# Altium project Thunderscope-E.PrjPCB (part 2 of 2)

## Sheet CON_PCIe_X4.SchDoc
size A4
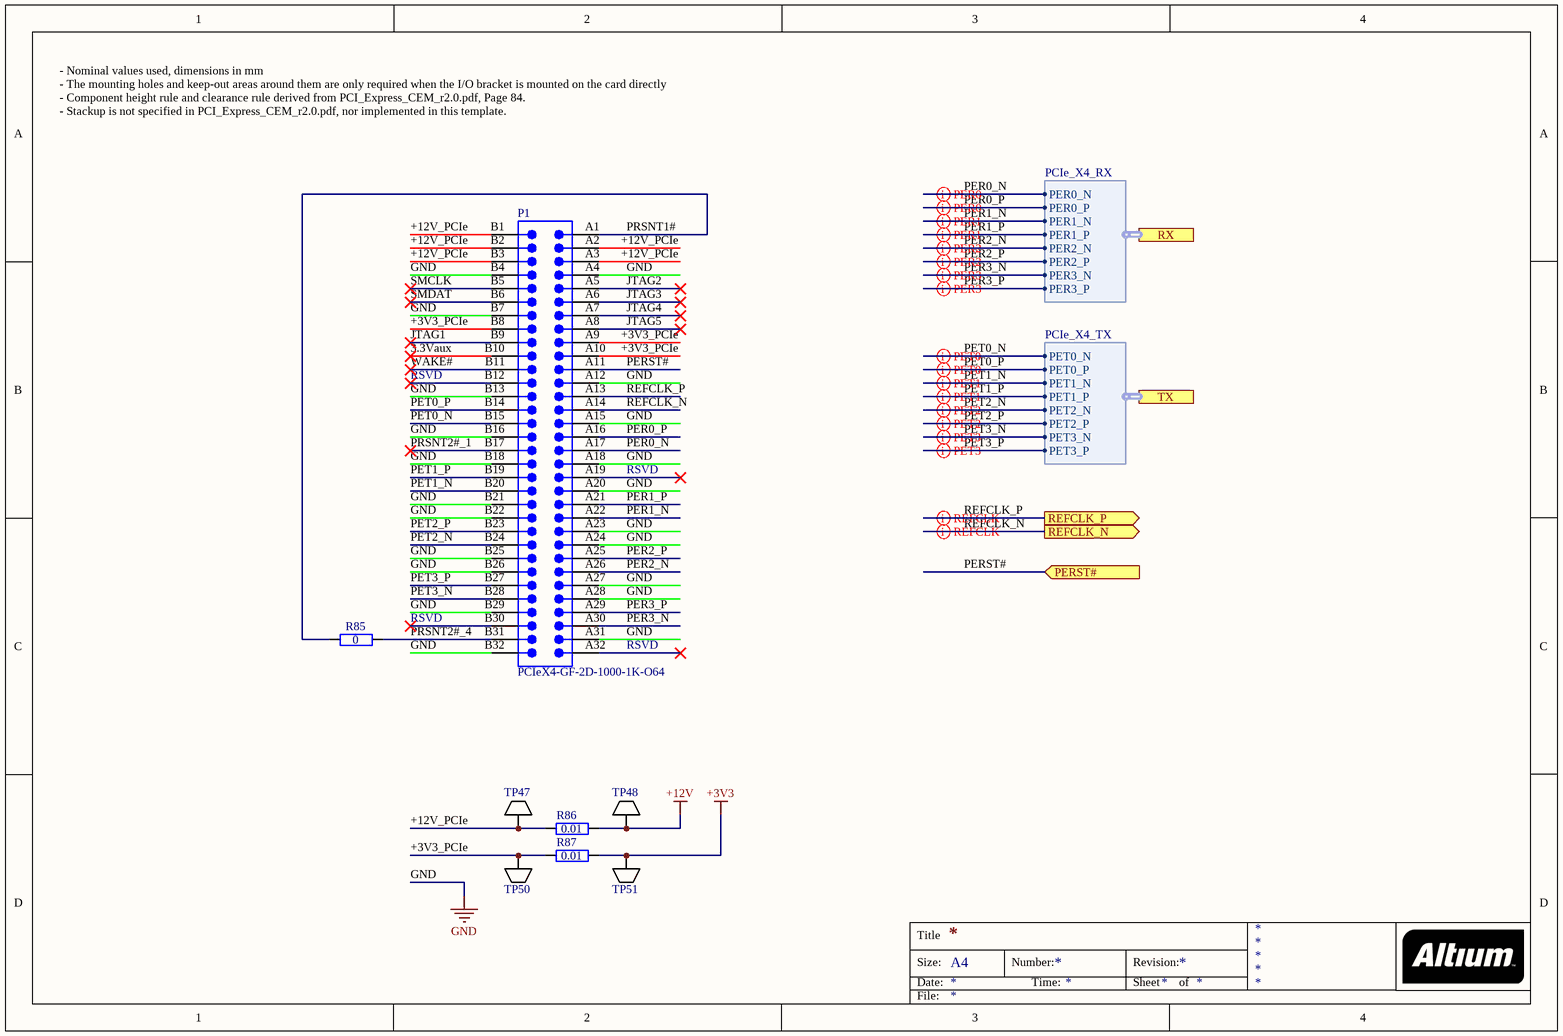
[diagram p8: CON_PCIe_X4.SchDoc]

### Parts
P1  PCIeX4-GF-2D-1000-1K-O64  [PCIeX4-GF-2D-1000-1K-O64]  (no BOM)
R85  0  [GEN_R_0402]
R86  0.01  [GEN_R_0603]
R87  0.01  [GEN_R_0603]
TP47  5015  [KEY_5015]  (value not drawn)
TP48  5015  [KEY_5015]  (value not drawn)
TP50  5015  [KEY_5015]  (value not drawn)
TP51  5015  [KEY_5015]  (value not drawn)

### Ports
PERST# (in), REFCLK_N (out), REFCLK_P (out), RX (harness PCIe_X4_RX), TX (harness PCIe_X4_TX)

### Harnesses
PCIe_X4_RX: PER0_N, PER0_P, PER1_N, PER1_P, PER2_N, PER2_P, PER3_N, PER3_P
PCIe_X4_TX: PET0_N, PET0_P, PET1_N, PET1_P, PET2_N, PET2_P, PET3_N, PET3_P

### Nets
+3V3: R87.2 TP51.1
+12V: R86.2 TP48.1
GND: P1.A4 P1.A12 P1.A15 P1.A18 P1.A20 P1.A23 P1.A24 P1.A27 P1.A28 P1.A31 P1.B4 P1.B7 P1.B13 P1.B16 P1.B18 P1.B21 P1.B22 P1.B25 P1.B26 P1.B29 P1.B32
3.3Vaux: P1.B10
+3V3_PCIe: P1.A9 P1.A10 P1.B8 R87.1 TP50.1
+12V_PCIe: P1.A2 P1.A3 P1.B1 P1.B2 P1.B3 R86.1 TP47.1
JTAG1: P1.B9
JTAG2: P1.A5
JTAG3: P1.A6
JTAG4: P1.A7
JTAG5: P1.A8
PER0_N: P1.A17 ; port RX.PER0_N
PER0_P: P1.A16 ; port RX.PER0_P
PER1_N: P1.A22 ; port RX.PER1_N
PER1_P: P1.A21 ; port RX.PER1_P
PER2_N: P1.A26 ; port RX.PER2_N
PER2_P: P1.A25 ; port RX.PER2_P
PER3_N: P1.A30 ; port RX.PER3_N
PER3_P: P1.A29 ; port RX.PER3_P
PERST#: P1.A11 ; port PERST#
PET0_N: P1.B15 ; port TX.PET0_N
PET0_P: P1.B14 ; port TX.PET0_P
PET1_N: P1.B20 ; port TX.PET1_N
PET1_P: P1.B19 ; port TX.PET1_P
PET2_N: P1.B24 ; port TX.PET2_N
PET2_P: P1.B23 ; port TX.PET2_P
PET3_N: P1.B28 ; port TX.PET3_N
PET3_P: P1.B27 ; port TX.PET3_P
PRSNT1#: P1.A1 R85.1
PRSNT2#_1: P1.B17
PRSNT2#_4: P1.B31 R85.2
REFCLK_N: P1.A14 ; port REFCLK_N
REFCLK_P: P1.A13 ; port REFCLK_P
SMCLK: P1.B5
SMDAT: P1.B6
WAKE#: P1.B11

Not connected (* = marked no-connect by the designer): P1 A19* A32* B12* B30*

### Layout directives
differential pair: PER0_N, PER0_P, PER1_N, PER1_P, PER2_N, PER2_P, PER3_N, PER3_P, PET0_N, PET0_P, PET1_N, PET1_P, PET2_N, PET2_P, PET3_N, PET3_P, REFCLK_N, REFCLK_P

### Notes on the sheet
- - Nominal values used, dimensions in mm
  - The mounting holes and keep-out areas around them are only required when the I/O bracket is mounted on the card directly
  - Component height rule and clearance rule derived from PCI_Express_CEM_r2.0.pdf, Page 84.
  - Stackup is not specified in PCI_Express_CEM_r2.0.pdf, nor implemented in this template.
- RSVD
- (near R85) RSVD
- Title
- Size:
- Date:
- A4
- Number:
- Time:
- Revision:
- Sheet
- of
- File:

### Library data of the parts
P1 = CMP-0001-00031-2: Golden finger, PCIeX4, Dual, Opposite, Pitch 1mm, 64-Position; Mating Connector: Molex-87715-9106; Datasheet Version: rev2.0, Apr-2007; Package Reference: PCIeX4-GF-2D-1000-1K-O64; ClassName: Edge Connector; Publisher: Altium
R85 = RES 0 OHM 1/16W 0402: Power Rating: 0.0625W; Package: 0402; Supplier 1: Digi-Key; Supplier Part Number 1: 311-0.0JRCT-ND; Value: 0
R86 R87 = RES 0.01 OHM 1% 1/4W 0603: Tolerance: 1%; Power Rating: 0.25W; Supplier 1: Digi-Key; Supplier Part Number 1: 408-1404-1-ND; Value: 0.01; Package: 0603
TP47 TP48 TP50 TP51 = TP KEYSTONE 5015: Supplier 1: Digi-Key; Supplier Part Number 1: 36-5015CT-ND

## Nets that join several sheets
+3V3: FE (5 pins), Front End/CH1/Input Coupling and Attenuation (D2A.1 K1A.1), Front End/CH1/PGA (C39A.2 R53A.2 U9A.12), Front End/CH2/Input Coupling and Attenuation (D2B.1 K1B.1), Front End/CH2/PGA (C39B.2 R53B.2 U9B.12), Front End/CH3/Input Coupling and Attenuation (D2C.1 K1C.1), Front End/CH3/PGA (C39C.2 R53C.2 U9C.12), Front End/CH4/Input Coupling and Attenuation (D2D.1 K1D.1), Front End/CH4/PGA (C39D.2 R53D.2 U9D.12), ADC (11 pins), FPGA (18 pins), CON_PCIe_X4 (R87.2 TP51.1)
+5V: Main (C77.1 U15.5), FE (12 pins), Front End/CH1/Buffer (10 pins), Front End/CH1/PGA (7 pins), Front End/CH2/Buffer (10 pins), Front End/CH2/PGA (7 pins), Front End/CH3/Buffer (10 pins), Front End/CH3/PGA (7 pins), Front End/CH4/Buffer (10 pins), Front End/CH4/PGA (7 pins)
+5V5: Main (R1.2 TP2.1), FE (R4.1 R5.1 TP8.1 TP9.1), ADC (R66.1 TP37.1)
+12V: Main (5 pins), CON_PCIe_X4 (R86.2 TP48.1)
-2V5_REF: FE (TP16.1 U4.2 U4.6), Front End/CH1/Buffer (C22A.1 R41A.1), Front End/CH2/Buffer (C22B.1 R41B.1), Front End/CH3/Buffer (C22C.1 R41C.1), Front End/CH4/Buffer (C22D.1 R41D.1)
-5V: FE (5 pins), Front End/CH1/Buffer (C29A.1 U6A.4), Front End/CH2/Buffer (C29B.1 U6B.4), Front End/CH3/Buffer (C29C.1 U6C.4), Front End/CH4/Buffer (C29D.1 U6D.4)
GND: Main (14 pins), FE (19 pins), Front End/CH1 (J1A.2 J2A.2 J3A.2 SHLD1A.1), Front End/CH1/Input Coupling and Attenuation (8 pins), Front End/CH1/Buffer (18 pins), Front End/CH1/PGA (9 pins), Front End/CH2 (J1B.2 J2B.2 J3B.2 SHLD1B.1), Front End/CH2/Input Coupling and Attenuation (8 pins), Front End/CH2/Buffer (18 pins), Front End/CH2/PGA (9 pins), Front End/CH3 (J1C.2 J2C.2 J3C.2 SHLD1C.1), Front End/CH3/Input Coupling and Attenuation (8 pins), Front End/CH3/Buffer (18 pins), Front End/CH3/PGA (9 pins), Front End/CH4 (J1D.2 J2D.2 J3D.2 SHLD1D.1), Front End/CH4/Input Coupling and Attenuation (8 pins), Front End/CH4/Buffer (18 pins), Front End/CH4/PGA (9 pins), ADC (42 pins), FPGA (57 pins), CON_PCIe_X4 (21 pins)
ACQ_EN: ADC (5 pins), FPGA (JM2.52)
ADC_CSn: ADC (R60.1 TP28.1 U11.2), FPGA (JM2.66)
ADC_PD: ADC (R62.1 TP30.1 U11.6), FPGA (JM2.62)
ADC_PG: ADC (R63.1 TP31.1 U10.5), FPGA (JM2.68)
ADC_RSTn: ADC (R61.1 TP29.1 U11.5), FPGA (JM2.64)
ADC_SCLK: ADC (TP33.1 U11.4), FPGA (JM2.42)
ADC_SDATA: ADC (TP32.1 U11.3), FPGA (JM2.44)
ATTEN: Front End/CH1 (TP21A.1), Front End/CH1/Input Coupling and Attenuation (R50A.2 R52A.2), FPGA (JM2.37)
ATTEN: Front End/CH2 (TP21B.1), Front End/CH2/Input Coupling and Attenuation (R50B.2 R52B.2), FPGA (JM2.47)
ATTEN: Front End/CH3 (TP21C.1), Front End/CH3/Input Coupling and Attenuation (R50C.2 R52C.2), FPGA (JM2.55)
ATTEN: Front End/CH4 (TP21D.1), Front End/CH4/Input Coupling and Attenuation (R50D.2 R52D.2), FPGA (JM2.63)
ATTEN_OUT: Front End/CH1/Input Coupling and Attenuation (C31A.1 K1A.6), Front End/CH1/Buffer (R30A.1)
ATTEN_OUT: Front End/CH2/Input Coupling and Attenuation (C31B.1 K1B.6), Front End/CH2/Buffer (R30B.1)
ATTEN_OUT: Front End/CH3/Input Coupling and Attenuation (C31C.1 K1C.6), Front End/CH3/Buffer (R30C.1)
ATTEN_OUT: Front End/CH4/Input Coupling and Attenuation (C31D.1 K1D.6), Front End/CH4/Buffer (R30D.1)
BUF_OUT: Front End/CH1/Buffer (Q3A.2 Q4A.3 R33A.1 R40A.2), Front End/CH1/PGA (U9A.6)
BUF_OUT: Front End/CH2/Buffer (Q3B.2 Q4B.3 R33B.1 R40B.2), Front End/CH2/PGA (U9B.6)
BUF_OUT: Front End/CH3/Buffer (Q3C.2 Q4C.3 R33C.1 R40C.2), Front End/CH3/PGA (U9C.6)
BUF_OUT: Front End/CH4/Buffer (Q3D.2 Q4D.3 R33D.1 R40D.2), Front End/CH4/PGA (U9D.6)
CH1_N: Front End/CH1 (R29A.2), ADC (R64.2 U11.47)
CH1_P: Front End/CH1 (R28A.2), ADC (R64.1 U11.46)
CH2_N: Front End/CH2 (R29B.2), ADC (R65.2 U11.44)
CH2_P: Front End/CH2 (R28B.2), ADC (R65.1 U11.43)
CH3_N: Front End/CH3 (R29C.2), ADC (R68.2 U11.41)
CH3_P: Front End/CH3 (R28C.2), ADC (R68.1 U11.40)
CH4_N: Front End/CH4 (R29D.2), ADC (R69.2 U11.38)
CH4_P: Front End/CH4 (R28D.2), ADC (R69.1 U11.37)
D1A_N: ADC (U11.10), FPGA (JM1.57)
D1A_P: ADC (U11.9), FPGA (JM1.55)
D1B_N: ADC (U11.12), FPGA (JM1.61)
D1B_P: ADC (U11.11), FPGA (JM1.59)
D2A_N: ADC (U11.14), FPGA (JM1.67)
D2A_P: ADC (U11.13), FPGA (JM1.65)
D2B_N: ADC (U11.16), FPGA (JM1.71)
D2B_P: ADC (U11.15), FPGA (JM1.69)
D3A_N: ADC (U11.22), FPGA (JM1.81)
D3A_P: ADC (U11.21), FPGA (JM1.79)
D3B_N: ADC (U11.24), FPGA (JM1.87)
D3B_P: ADC (U11.23), FPGA (JM1.85)
D4A_N: ADC (U11.26), FPGA (JM1.95)
D4A_P: ADC (U11.25), FPGA (JM1.93)
D4B_N: ADC (U11.28), FPGA (JM1.99)
D4B_P: ADC (U11.27), FPGA (JM1.97)
DC_CPL: Front End/CH1 (TP22A.1), Front End/CH1/Input Coupling and Attenuation (U8A.1), FPGA (JM2.41)
DC_CPL: Front End/CH2 (TP22B.1), Front End/CH2/Input Coupling and Attenuation (U8B.1), FPGA (JM2.51)
DC_CPL: Front End/CH3 (TP22C.1), Front End/CH3/Input Coupling and Attenuation (U8C.1), FPGA (JM2.57)
DC_CPL: Front End/CH4 (TP22D.1), Front End/CH4/Input Coupling and Attenuation (U8D.1), FPGA (JM2.65)
FCLK_N: ADC (U11.20), FPGA (JM1.78)
FCLK_P: ADC (U11.19), FPGA (JM1.76)
FE_EN: FE (R8.2 TP13.1 U2.7 U3.6), FPGA (JM2.54)
FE_IN: Front End/CH1 (J3A.1), Front End/CH1/Input Coupling and Attenuation (C30A.2 GDT1A.1 U8A.4)
FE_IN: Front End/CH2 (J3B.1), Front End/CH2/Input Coupling and Attenuation (C30B.2 GDT1B.1 U8B.4)
FE_IN: Front End/CH3 (J3C.1), Front End/CH3/Input Coupling and Attenuation (C30C.2 GDT1C.1 U8C.4)
FE_IN: Front End/CH4 (J3D.1), Front End/CH4/Input Coupling and Attenuation (C30D.2 GDT1D.1 U8D.4)
FE_PG: FE (R13.1 TP11.1 U2.5), FPGA (JM2.46)
LCLK_N: ADC (U11.18), FPGA (JM1.62)
LCLK_P: ADC (U11.17), FPGA (JM1.60)
OSC_OE: ADC (R72.2 TP38.1 U13.1), FPGA (JM2.48)
OUT_N_CH1: Front End/CH1 (J1A.1 R29A.1), Front End/CH1/PGA (U9A.14)
OUT_N_CH2: Front End/CH2 (J1B.1 R29B.1), Front End/CH2/PGA (U9B.14)
OUT_N_CH3: Front End/CH3 (J1C.1 R29C.1), Front End/CH3/PGA (U9C.14)
OUT_N_CH4: Front End/CH4 (J1D.1 R29D.1), Front End/CH4/PGA (U9D.14)
OUT_P_CH1: Front End/CH1 (J2A.1 R28A.1), Front End/CH1/PGA (U9A.15)
OUT_P_CH2: Front End/CH2 (J2B.1 R28B.1), Front End/CH2/PGA (U9B.15)
OUT_P_CH3: Front End/CH3 (J2C.1 R28C.1), Front End/CH3/PGA (U9C.15)
OUT_P_CH4: Front End/CH4 (J2D.1 R28D.1), Front End/CH4/PGA (U9D.15)
PER0_N: FPGA (C71.2), CON_PCIe_X4 (P1.A17)
PER0_P: FPGA (C72.2), CON_PCIe_X4 (P1.A16)
PER1_N: FPGA (C69.2), CON_PCIe_X4 (P1.A22)
PER1_P: FPGA (C70.2), CON_PCIe_X4 (P1.A21)
PER2_N: FPGA (C67.2), CON_PCIe_X4 (P1.A26)
PER2_P: FPGA (C68.2), CON_PCIe_X4 (P1.A25)
PER3_N: FPGA (C65.2), CON_PCIe_X4 (P1.A30)
PER3_P: FPGA (C66.2), CON_PCIe_X4 (P1.A29)
PERST#: FPGA (R79.1), CON_PCIe_X4 (P1.A11)
PET0_N: FPGA (JM3.25), CON_PCIe_X4 (P1.B15)
PET0_P: FPGA (JM3.27), CON_PCIe_X4 (P1.B14)
PET1_N: FPGA (JM3.19), CON_PCIe_X4 (P1.B20)
PET1_P: FPGA (JM3.21), CON_PCIe_X4 (P1.B19)
PET2_N: FPGA (JM3.13), CON_PCIe_X4 (P1.B24)
PET2_P: FPGA (JM3.15), CON_PCIe_X4 (P1.B23)
PET3_N: FPGA (JM3.7), CON_PCIe_X4 (P1.B28)
PET3_P: FPGA (JM3.9), CON_PCIe_X4 (P1.B27)
PGA_CSn: Front End/CH1 (TP20A.1), Front End/CH1/PGA (R53A.1 U9A.9), FPGA (JM2.35)
PGA_CSn: Front End/CH2 (TP20B.1), Front End/CH2/PGA (R53B.1 U9B.9), FPGA (JM2.45)
PGA_CSn: Front End/CH3 (TP20C.1), Front End/CH3/PGA (R53C.1 U9C.9), FPGA (JM2.53)
PGA_CSn: Front End/CH4 (TP20D.1), Front End/CH4/PGA (R53D.1 U9D.9), FPGA (JM2.61)
PGA_SCLK: FE (TP14.1), Front End/CH1/PGA (U9A.11), Front End/CH2/PGA (U9B.11), Front End/CH3/PGA (U9C.11), Front End/CH4/PGA (U9D.11), FPGA (JM2.33)
PGA_SDIO: FE (TP15.1), Front End/CH1/PGA (U9A.10), Front End/CH2/PGA (U9B.10), Front End/CH3/PGA (U9C.10), Front End/CH4/PGA (U9D.10), FPGA (JM2.31)
PROBE_COMP: Main (R84.2 U15.2), FPGA (JM2.43)
REFCLK_N: FPGA (C73.2), CON_PCIe_X4 (P1.A14)
REFCLK_P: FPGA (C74.2), CON_PCIe_X4 (P1.A13)
SCL: FE (Q1.3 R24.1), ADC (R77.1 TP41.1 U13.8), FPGA (JM2.58)
SDA: FE (Q2.3 R25.1), ADC (R76.1 TP39.1 U13.7), FPGA (JM2.56)
TRIM: FE (R16.1), Front End/CH1/PGA (R54A.1 R55A.2 TP24A.1 U9A.7)
TRIM: FE (R19.1), Front End/CH2/PGA (R54B.1 R55B.2 TP24B.1 U9B.7)
TRIM: FE (R21.1), Front End/CH3/PGA (R54C.1 R55C.2 TP24C.1 U9C.7)
TRIM: FE (R23.1), Front End/CH4/PGA (R54D.1 R55D.2 TP24D.1 U9D.7)
VCM: FE (TP12.1), Front End/CH1/PGA (U9A.13), Front End/CH2/PGA (U9B.13), Front End/CH3/PGA (U9C.13), Front End/CH4/PGA (U9D.13), ADC (U11.48)